# Altium schematic sheet CAN_PHY.SchDoc
size A4; SheetNumber: 14; SheetTotal: 21
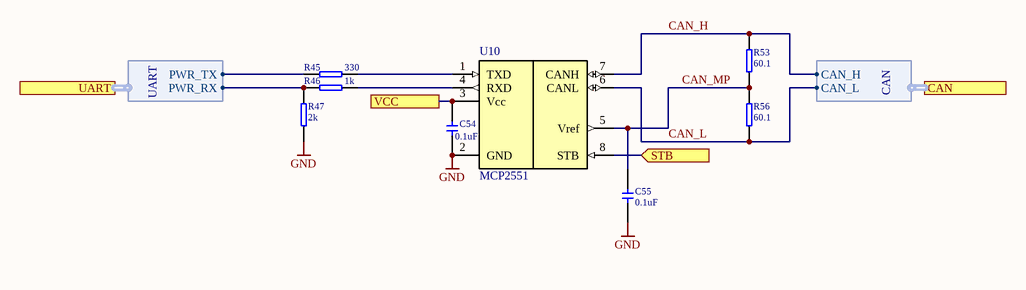
[diagram p0: CAN_PHY.SchDoc]

## Parts
C54  value 0.1uF  [CERCAP 0402]
C55  value 0.1uF  [CERCAP 0402]
R45  value 330  [RES 0402]
R46  value 1k  [RES 0402]
R47  value 2k  [RES 0402]
R53  value 60.1  [RES 0402]
R56  value 60.1  [RES 0402]
U10  MCP2551  [SO-8]

## Ports
CAN (harness CAN), STB (in), UART (harness UART), VCC

## Harnesses
CAN: CAN_H, CAN_L
UART: PWR_RX, PWR_TX

## Nets
GND: C54.1 C55.1 R47.1 U10.2(GND)
CAN_H: R53.2 U10.7(CANH) ; port CAN.CAN_H
CAN_L: R56.1 U10.6(CANL) ; port CAN.CAN_L
CAN_MP: C55.2 R53.1 R56.2 U10.5(Vref)
STB: U10.8(STB) ; port STB
VCC: C54.2 U10.3(Vcc) ; port VCC
NetR45_1: R45.1 ; port UART.PWR_TX
NetR45_2: R45.2 U10.1(TXD)
NetR46_1: R46.1 R47.2 ; port UART.PWR_RX
NetR46_2: R46.2 U10.4(RXD)

## Library data of the parts
C54 C55 = !Capacitor: Capacitor; IsSMT: NoSMT; Voltage: 50V; Diel: X7R
R45-R47 R53 R56 = !Resistor: Resistor; IsSMT: NoSMT
U10 = CAN_PHY: CAN PHY